# EAGLE design toiletino (EAGLE 9.5.2)
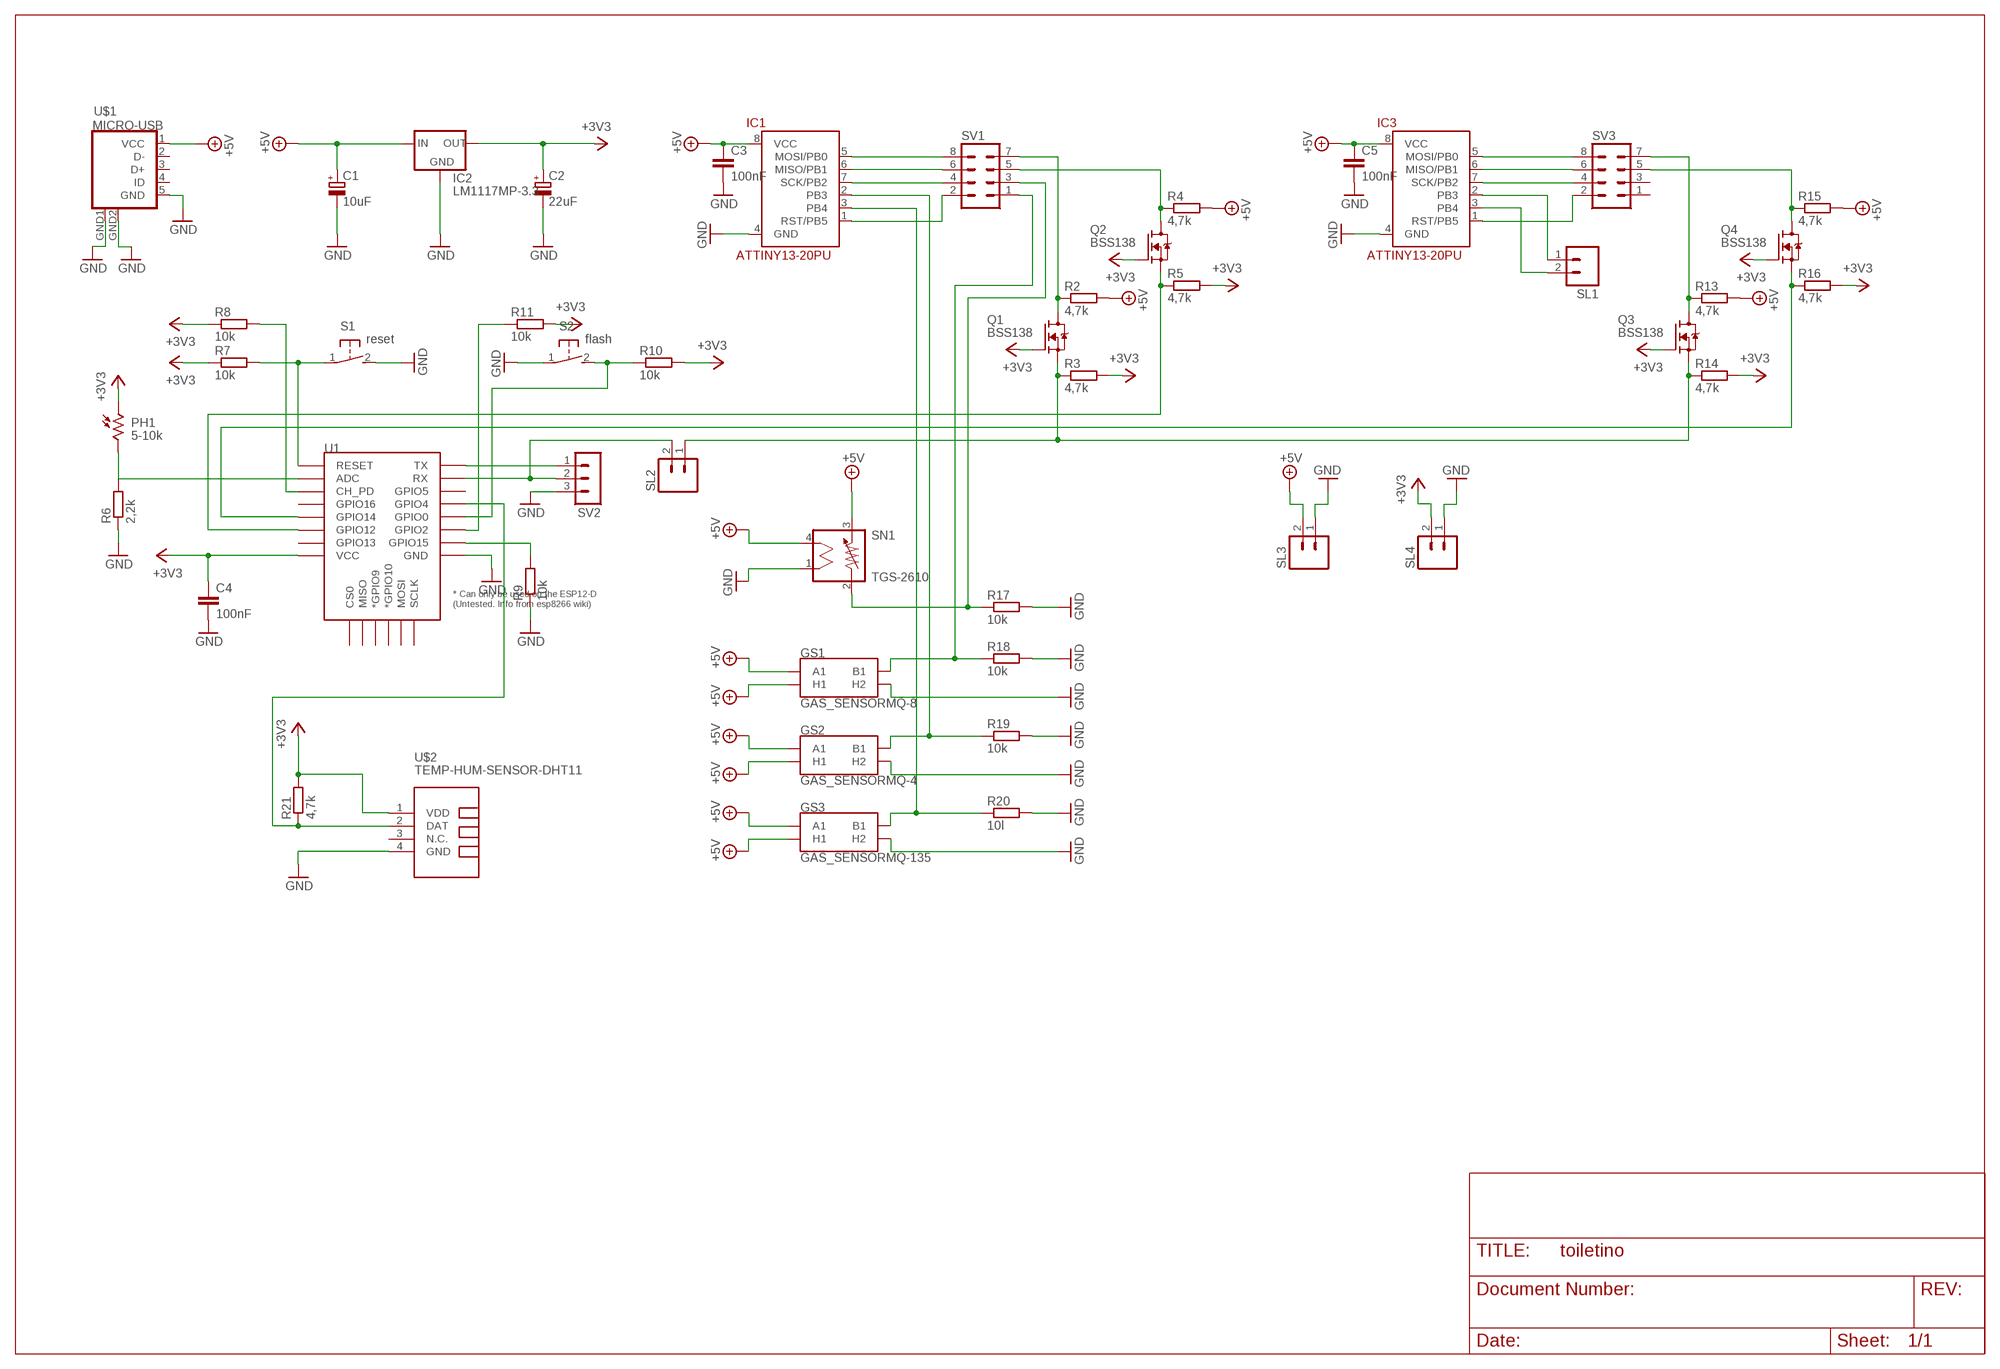
[diagram p0: schematic, sheet 1]

## Parts
C1  10uF  CPOL-EUE2.5-6  [E2,5-6]
C2  22uF  CPOL-EUE2.5-6  [E2,5-6]
C3  100nF  C-EU025-025X050  [C025-025X050]
C4  100nF  C-EU025-025X050  [C025-025X050]
C5  100nF  C-EU025-025X050  [C025-025X050]
GS1  GAS_SENSORMQ-8  [GAS_SENSOR]
GS2  GAS_SENSORMQ-4  [GAS_SENSOR]
GS3  GAS_SENSORMQ-135  GAS_SENSORMQ-3  [GAS_SENSOR]
IC1  ATTINY13-20PU  [DIL08]
IC2  LM1117MP-3.3  [SOT223]
IC3  ATTINY13-20PU  [DIL08]
PH1  5-10k  V1060_21  [TO-5_V10]
Q1  BSS138  [SOT23]
Q2  BSS138  [SOT23]
Q3  BSS138  [SOT23]
Q4  BSS138  [SOT23]
R2  4,7k  R-EU_0207/10  [0207/10]
R3  4,7k  R-EU_0207/10  [0207/10]
R4  4,7k  R-EU_0207/10  [0207/10]
R5  4,7k  R-EU_0207/10  [0207/10]
R6  2,2k  R-EU_0207/10  [0207/10]
R7  10k  R-EU_0207/10  [0207/10]
R8  10k  R-EU_0207/10  [0207/10]
R9  10k  R-EU_0207/10  [0207/10]
R10  10k  R-EU_0207/10  [0207/10]
R11  10k  R-EU_0207/10  [0207/10]
R13  4,7k  R-EU_0207/10  [0207/10]
R14  4,7k  R-EU_0207/10  [0207/10]
R15  4,7k  R-EU_0207/10  [0207/10]
R16  4,7k  R-EU_0207/10  [0207/10]
R17  10k  R-EU_0207/10  [0207/10]
R18  10k  R-EU_0207/10  [0207/10]
R19  10k  R-EU_0207/10  [0207/10]
R20  10l  R-EU_0207/10  [0207/10]
R21  4,7k  R-EU_0207/10  [0207/10]
S1  reset  DTS-3  [DTS-3]
S2  flash  DTS-3  [DTS-3]
SL1  MA02  [02PA]
SL2  MA02  [02PA]
SL3  MA02  [02PA]
SL4  MA02  [02PA]
SN1  TGS-2610  [TGS-2610]
SV1  MA04-2  [MA04-2]
SV2  MA03-1  [MA03-1]
SV3  MA04-2  [MA04-2]
U1  ESP12ESMD  [ESP12E-SMD]
U$1  MICRO-USB  [MICRO-USB]
U$2  TEMP-HUM-SENSOR-DHT11  [TEMP-HUM-SENSOR-DHT11]

## Nets
+3V3: C2.+ C4.1 IC2.2(OUT) IC2.4(OUT) PH1.1 Q1.1(G) Q2.1(G) Q3.1(G) Q4.1(G) R3.2 R5.2 R7.1 R8.1 R10.2 R11.2 R14.2 R16.2 R21.2 SL4.2 U1.VCC U$2.1(VDD)
+5V [small smd]: C1.+ C3.1 C5.1 GS1.A1 GS1.A2(A1) GS1.HA(H1) GS2.A1 GS2.A2(A1) GS2.HA(H1) GS3.A1 GS3.A2(A1) GS3.HA(H1) IC1.8(VCC) IC2.3(IN) IC3.8(VCC) R2.2 R4.2 R13.2 R15.2 SL3.2 SN1.3 SN1.4 U$1.1(VCC)
GND [GND]: C1.- C2.- C3.2 C4.2 C5.2 GS1.HB(H2) GS2.HB(H2) GS3.HB(H2) IC1.4(GND) IC2.1(GND) IC3.4(GND) R6.1 R9.1 R17.2 R18.2 R19.2 R20.2 S1.2 S2.1 SL3.1 SL4.1 SN1.1 SV2.3 U1.GND U$1.5(GND) U$1.GND1(GND) U$1.GND2(GND) U$2.4(GND)
N$1: IC1.1(RST/PB5) SV1.2
N$2: IC1.7(SCK/PB2) SV1.4
N$3: IC1.6(MISO/PB1) SV1.6
N$4: IC1.5(MOSI/PB0) SV1.8
N$5: Q2.3(D) R4.1 SV1.5
N$6: Q1.3(D) R2.1 SV1.7
N$7: Q1.2(S) Q3.2(S) R3.1 R14.1 SL2.1
N$8: Q2.2(S) R5.1 U1.GPIO12
N$9: SV2.1 U1.TXD0(TX)
N$10: PH1.2 R6.2 U1.ADC
N$11: R7.2 S1.1 U1.RESET
N$12: R8.2 U1.CH_PD
N$13: R9.2 U1.GPIO15
N$14: R11.1 U1.GPIO2
N$15: R10.1 S2.2 U1.GPIO0
N$16: IC3.1(RST/PB5) SV3.2
N$17: IC3.7(SCK/PB2) SV3.4
N$18: IC3.6(MISO/PB1) SV3.6
N$19: IC3.5(MOSI/PB0) SV3.8
N$20: Q4.3(D) R15.1 SV3.5
N$21: Q3.3(D) R13.1 SV3.7
N$22: Q4.2(S) R16.1 U1.GPIO14
N$23: R17.1 SN1.2 SV1.3
N$24: IC3.2(PB3) SL1.1
N$25: IC3.3(PB4) SL1.2
N$26: GS1.B1 GS1.B2(B1) R18.1 SV1.1
N$27: R21.1 U1.GPIO4 U$2.2(DAT)
N$28: GS2.B1 GS2.B2(B1) IC1.2(PB3) R19.1
N$29: SL2.2 SV2.2 U1.RXD0(RX)
N$30: GS3.B1 GS3.B2(B1) IC1.3(PB4) R20.1
Unconnected: SV3.1 SV3.3 U1.CS0 U1.GPIO5 U1.GPIO9(*GPIO9) U1.GPIO10(*GPIO10) U1.GPIO13 U1.GPIO16 U1.MISO U1.MOSI U1.SCLK U$1.2(D-) U$1.3(D+) U$1.4(ID) U$2.3(N.C.)

## Library data of the parts
C1 C2 = rcl:CPOL-EU: POLARIZED CAPACITOR, European symbol; SPICEPREFIX: C
C3-C5 = rcl:C-EU: CAPACITOR, European symbol; SPICEPREFIX: C
GS1 = SparkFun-Sensors:GAS_SENSOR: Gas Sensors - MQ-3, MQ-4, MQ-6, MQ-7, MQ-8 Through-hole gas sensors with a heating coil and an analog output. Example Datasheet <https://cdn.sparkfun.com/datasheets/Sensors/Biometric/MQ-3%20ver1.3%20-%20Manual.pdf> SparkFun Products Gas Sensor Breakout Board <https://www.sparkfun.com/products/8891> (BOB-8891) - Breakout board compatible with all gas sensors. Alcohol Gas Sensor - MQ-3 <https://www.sparkfun.com/products/8880> (SEN-08880) Methane CNG Gas Sensor - MQ-4 <https://www.sparkfun.com/products/9404> (SEN-09404) LPG Gas Sensor - MQ-6 <https://www.sparkfun.com/products/9405> (SEN-09405) Carbon Monoxide Sensor - MQ-7 <https://www.sparkfun.com/products/9403> (SEN-09403) Hydrogen Gas Sensor - MQ-8 <https://www.sparkfun.com/products/10916> (SEN-10916); PROD_ID: COMP-13351; SF_ID: SEN-10916
GS2 = SparkFun-Sensors:GAS_SENSOR: Gas Sensors - MQ-3, MQ-4, MQ-6, MQ-7, MQ-8 Through-hole gas sensors with a heating coil and an analog output. Example Datasheet <https://cdn.sparkfun.com/datasheets/Sensors/Biometric/MQ-3%20ver1.3%20-%20Manual.pdf> SparkFun Products Gas Sensor Breakout Board <https://www.sparkfun.com/products/8891> (BOB-8891) - Breakout board compatible with all gas sensors. Alcohol Gas Sensor - MQ-3 <https://www.sparkfun.com/products/8880> (SEN-08880) Methane CNG Gas Sensor - MQ-4 <https://www.sparkfun.com/products/9404> (SEN-09404) LPG Gas Sensor - MQ-6 <https://www.sparkfun.com/products/9405> (SEN-09405) Carbon Monoxide Sensor - MQ-7 <https://www.sparkfun.com/products/9403> (SEN-09403) Hydrogen Gas Sensor - MQ-8 <https://www.sparkfun.com/products/10916> (SEN-10916); PROD_ID: COMP-11559; SF_ID: SEN-09404
GS3 = SparkFun-Sensors:GAS_SENSOR: Gas Sensors - MQ-3, MQ-4, MQ-6, MQ-7, MQ-8 Through-hole gas sensors with a heating coil and an analog output. Example Datasheet <https://cdn.sparkfun.com/datasheets/Sensors/Biometric/MQ-3%20ver1.3%20-%20Manual.pdf> SparkFun Products Gas Sensor Breakout Board <https://www.sparkfun.com/products/8891> (BOB-8891) - Breakout board compatible with all gas sensors. Alcohol Gas Sensor - MQ-3 <https://www.sparkfun.com/products/8880> (SEN-08880) Methane CNG Gas Sensor - MQ-4 <https://www.sparkfun.com/products/9404> (SEN-09404) LPG Gas Sensor - MQ-6 <https://www.sparkfun.com/products/9405> (SEN-09405) Carbon Monoxide Sensor - MQ-7 <https://www.sparkfun.com/products/9403> (SEN-09403) Hydrogen Gas Sensor - MQ-8 <https://www.sparkfun.com/products/10916> (SEN-10916); PROD_ID: COMP-12216; SF_ID: SEN-08880
IC1 IC3 = attiny13:ATTINY13-20*
IC2 = lm1117_10:LM1117?-*: 800mA Low-Dropout Linear Regulator Source: http://www.ti.com/lit/ds/symlink/lm1117-n.pdf; MF: Texas Instruments; MPN: LM1117MP-3.3; OC_FARNELL: 9778195; OC_NEWARK: 28X3416
PH1 = photo-elements:?1060*: Sensor Street Light control Source: http://optoelectronics.perkinelmer.com/content/Datasheets/DTS_PhotocellsB1060.pdf
Q1-Q4 = bss138_10:BSS138: BSS138 N-Channel Logic Level Enhancement Mode Field Effect Transistor Source: http://www.fairchildsemi.com/datasheets/BS/BSS138.pdf; MF: Fairchild; MPN: BSS138; OC_FARNELL: 9845330; OC_NEWARK: 67R2009
R2-R11 R13-R21 = rcl:R-EU_: RESISTOR, European symbol; SPICEPREFIX: R
S1 S2 = switch-tact:DTS-3
SL1-SL4 = con-amp-quick:MA02: AMP QUICK CONNECTOR; OC_FARNELL: unknown; OC_NEWARK: unknown
SN1 = figaro:TGS-2610: SENSOR TGS 2610 - Gas Sensor
SV1 SV3 = con-lstb:MA04-2: PIN HEADER; OC_FARNELL: unknown; OC_NEWARK: unknown
SV2 = con-lstb:MA03-1: PIN HEADER; OC_FARNELL: unknown; OC_NEWARK: unknown
U1 = esp8266modules:ESP12E: ESP12E Module
U$1 = microusb:MICRO-USB: Micro USB B connector
U$2 = diy-modules:TEMP-HUM-SENSOR-DHT11: DHT11 - digital humidity & temperature sensor DHT11 datasheet available here: https://akizukidenshi.com/download/ds/aosong/DHT11.pdf Click here to find device on ebay.com <http://www.ebay.com/sch/dht11+digital+sensor>

## Net classes
0 default: width 0.508 mm
1 power line: width 0.813 mm
3 GND: clearance 0.305 mm

## Board
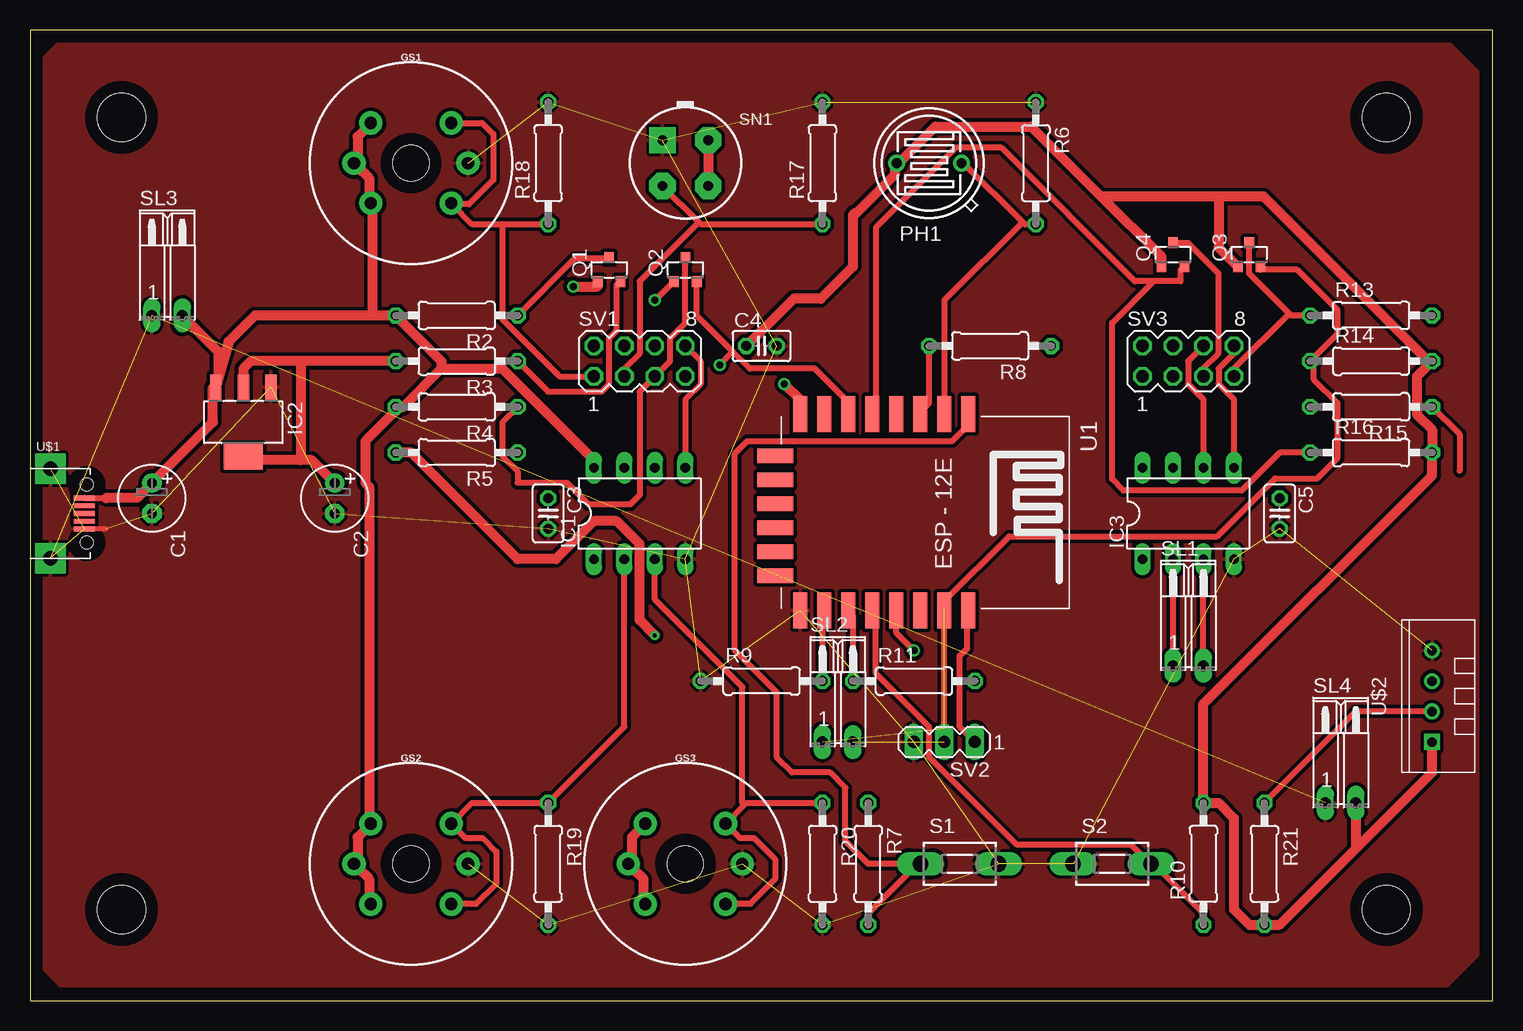
[diagram p1: board, top side]
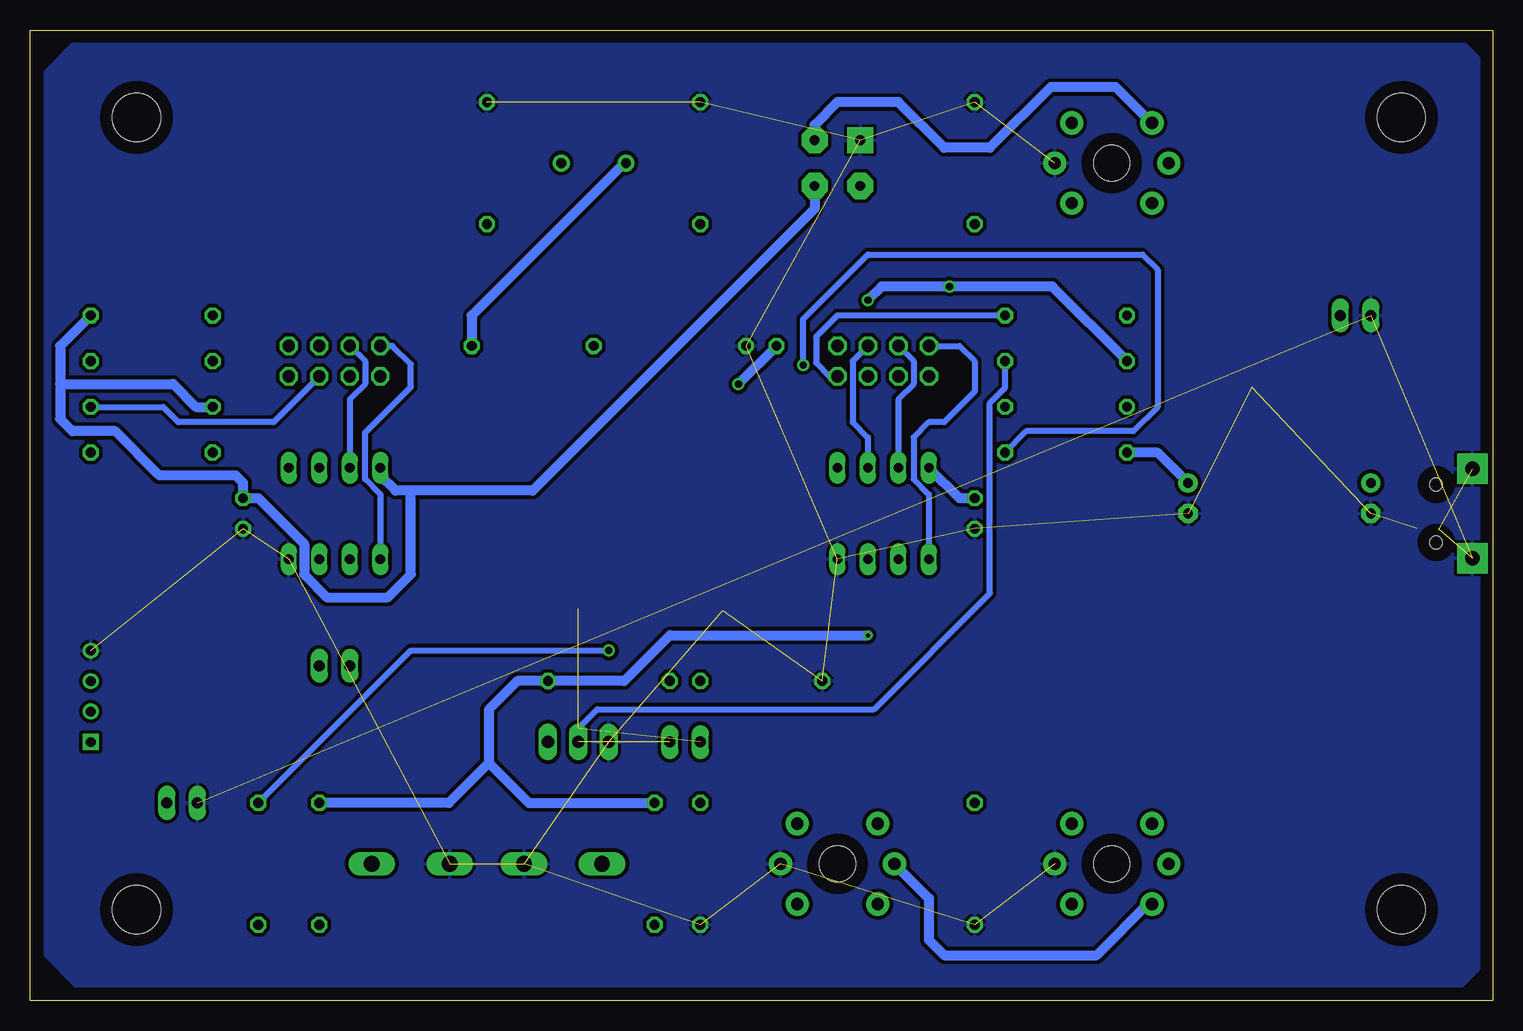
[diagram p2: board, bottom side, seen from below]

Size 121.9 x 80.95 mm. Coordinates in mm from the lower left corner, seen from the top.
Outline: 0,0 121.9,0 121.9,80.95 0,80.95 0,0
Copper layers (1*16): Top 0.035mm / dielectric 1.5mm / Bottom 0.035mm
Design rules "default *": minimum track width 6mil, minimum drill 0.35mm, track to track 12.5mil, track to pad 6mil, pad to pad 6mil, via to via 6mil, smd to smd 6mil, copper to edge 40mil, drill to drill 6mil, minimum pad ring 10mil, minimum via ring 8mil, stop-mask expansion 4mil, vias tented up to drill 0mil, thermal gap 10mil
Holes 4 mm at 7.62,73.66 7.62,7.62 113.03,7.62 113.03,73.66

### Footprints (pad centres in the part's own frame; a part is rotated, then mirrored left to right if it is on the bottom)
E2,5-6 = drill 0.813 pad 1.6: + -1.27,0 | drill 0.813 pad 1.6 octagon: - 1.27,0
C025-025X050 = drill 0.813 octagon: 1 -1.27,0; 2 1.27,0
GAS_SENSOR = drill 1.016 pad 1.93: A1 -3.35,3.35; A2 -3.35,-3.35; B1 3.35,3.35; B2 3.35,-3.35; HA -4.75,0; HB 4.75,0 | hole 3: 0,0
DIL08 = drill 0.813 long: 1 -3.81,-3.81; 2 -1.27,-3.81; 3 1.27,-3.81; 4 3.81,-3.81; 5 3.81,3.81; 6 1.27,3.81; 7 -1.27,3.81; 8 -3.81,3.81
SOT223 = smd 0.95 x 2.15: 1 -2.3,-2.9; 2 0,-2.9; 3 2.3,-2.9 | smd 3.25 x 2.15: 4 0,2.9
TO-5_V10 = drill 0.8 pad 1.4: 1 -2.7,0; 2 2.7,0
SOT23 = smd 0.8 x 0.9: 1 -0.95,-1; 2 0.95,-1; 3 0,1
0207/10 = drill 0.813 octagon: 1 -5.08,0; 2 5.08,0
DTS-3 = drill 1.3 long: 1 -3.25,0; 2 3.25,0
02PA = drill 0.914 long: 1 -1.27,0; 2 1.27,0
TGS-2610 = drill 0.813 pad 2.184 square: 1 -1.905,1.905 | drill 0.813 pad 2.184 octagon: 2 -1.905,-1.905; 3 1.905,-1.905; 4 1.905,1.905
MA04-2 = drill 1.016 octagon: 1 -3.81,-1.27; 2 -3.81,1.27; 3 -1.27,-1.27; 4 -1.27,1.27; 5 1.27,-1.27; 6 1.27,1.27; 7 3.81,-1.27; 8 3.81,1.27
MA03-1 = drill 1.016 long: 1 -2.54,0; 2 0,0; 3 2.54,0
ESP12E-SMD = smd 3 x 1.2: ADC -8.3,3.8; CH_PD -8.3,1.8; GND 8.1,-8.2; GPIO0 8.1,-2.2; GPIO2 8.1,-4.2; GPIO4 8.1,-0.2; GPIO5 8.1,1.8; GPIO12 -8.3,-4.2; GPIO13 -8.3,-6.2; GPIO14 -8.3,-2.2; GPIO15 8.1,-6.2; GPIO16 -8.3,-0.2; RESET -8.3,5.8; RXD0 8.1,3.8; TXD0 8.1,5.8; VCC -8.3,-8.2 | smd 1.2 x 3: CS0 -4.8,-10.3; GPIO9 -0.8,-10.3; GPIO10 1.2,-10.3; MISO -2.8,-10.3; MOSI 3.2,-10.3; SCLK 5.2,-10.3
MICRO-USB = smd 0.4 x 1.75: 1 -1.3,4.525; 2 -0.65,4.525; 3 0,4.525; 4 0.65,4.525; 5 1.3,4.525 | drill 1.2 pad 2.54 square: GND1 -3.725,1.7; GND2 3.725,1.7 | hole 1.05: -2.425,4.73; 2.425,4.73
TEMP-HUM-SENSOR-DHT11 = drill 0.8 square: 1 -3.81,0 | drill 0.8: 2 -1.27,0; 3 1.27,0; 4 3.81,0

### Placement (x,y rotation side)
C1  10.16,41.91 270 top
C2  25.4,41.91 270 top
C3  43.18,40.64 270 top
C4  60.96,54.61 0 top
C5  104.14,40.64 270 top
GS1  31.75,69.85 0 top
GS2  31.75,11.43 0 top
GS3  54.61,11.43 0 top
IC1  50.8,40.64 0 top
IC2  17.78,48.26 180 top
IC3  96.52,40.64 0 top
PH1  74.93,69.85 0 top
Q1  48.26,60.96 0 top
Q2  54.61,60.96 0 top
Q3  101.6,62.23 0 top
Q4  95.25,62.23 0 top
R2  35.56,57.15 180 top
R3  35.56,53.34 180 top
R4  35.56,49.53 180 top
R5  35.56,45.72 180 top
R6  83.82,69.85 270 top
R7  69.85,11.43 270 top
R8  80.01,54.61 180 top
R9  60.96,26.67 0 top
R10  97.79,11.43 90 top
R11  73.66,26.67 0 top
R13  111.76,57.15 0 top
R14  111.76,53.34 0 top
R15  111.76,49.53 180 top
R16  111.76,45.72 0 top
R17  66.04,69.85 90 top
R18  43.18,69.85 90 top
R19  43.18,11.43 270 top
R20  66.04,11.43 270 top
R21  102.87,11.43 270 top
S1  77.47,11.43 0 top
S2  90.17,11.43 0 top
SL1  96.52,27.94 0 top
SL2  67.31,21.59 0 top
SL3  11.43,57.15 0 top
SL4  109.22,16.51 0 top
SN1  54.61,69.85 0 top
SV1  50.8,53.34 0 top
SV2  76.2,21.59 180 top
SV3  96.52,53.34 0 top
U1  72.39,40.64 270 top
U$1  0,40.64 270 top
U$2  116.84,25.4 90 top

### Tracks (layer width: path | path; a pad name or v marks a point on that pad's centre or on a via)
+3V3  (via drill 0.35, 0.6)
  Top 0.508: Q2.1 52.12,58.42
  Top 0.813: 89.28,67.06 83.44,72.9 75.44,72.9 72.39,69.85 PH1.1 72.07,69.53 72.07,68.9 68.83,65.66 68.71,65.66 68.58,65.53 68.58,61.21 65.91,58.55 63.63,58.55 C4.1 | Q4.1 94.3,62.04 89.28,67.06 | v62.87,51.44 64.14,50.16 64.14,49.21 U1.VCC | 22.54,45.09 23.5,45.09 C2.+ | 22.54,45.09 17.78,45.09 IC2.4 | v45.28,59.56 47.31,59.56 Q1.1 | R3.2 22.54,53.34 | 22.54,53.34 18.41,53.34 17.78,52.7 IC2.2 | 22.54,53.34 22.54,45.09 | R5.2 31.75,45.72 40.64,36.83 43.81,36.83 46.99,40.01 48.9,40.01 50.8,38.1 50.8,31.75 v52.07,30.48 | Q3.1 99.06,62.82 99.06,67.06 | 52.12,58.42 v52.07,58.42 | U$2.1 116.84,19.05 110.49,12.7 | 110.49,12.7 104.14,6.35 R21.2 101.6,6.35 100.33,7.62 100.33,15.24 99.06,16.51 R10.2 97.79,24.77 116.84,43.81 R16.2 116.84,47.62 115.57,48.89 115.57,52.07 R14.2 116.68,53.18 102.81,67.06 99.06,67.06 | 99.06,67.06 89.28,67.06 | SL4.2 110.49,12.7
  Bottom 0.813: R8.1 85.09,57.15 72.39,69.85 PH1.1 | C4.1 v62.87,51.44 | R5.2 27.94,45.72 C2.+ | R3.2 36.7,59.56 v45.28,59.56 50.93,59.56 v52.07,58.42 | R7.1 80.33,16.51 83.66,19.84 | R10.2 87,16.51 83.66,19.84 | 83.66,19.84 83.66,24.29 81.28,26.67 R11.2 78.74,26.35 78.42,26.67 72.39,26.67 68.58,30.48 v52.07,30.48
+5V
  Top 0.406: 6.34,41.92 6.35,41.91
  Top 0.508: U$1.1 6.32,41.94 6.34,41.92
  Top 0.813: SN1.4 SN1.3 | GS1.A1 28.26,73.03 27.3,72.07 27.3,69.85 GS1.HA 27.3,69.53 28.26,68.58 28.26,66.67 GS1.A2 28.57,66.36 28.57,57.15 | GS2.A2 28.26,8.25 28.26,10.16 27.3,11.11 GS2.HA 27.3,11.43 27.3,13.65 28.26,14.61 GS2.A1 28.26,14.92 28.26,42.86 27.94,43.18 27.94,46.67 30.48,49.21 R4.2 31.11,49.53 34.29,52.7 | GS3.A1 51.12,14.61 50.16,13.65 50.16,11.43 GS3.HA 50.16,11.11 51.12,10.16 51.12,8.25 GS3.A2 | 34.29,52.7 34.29,53.34 R2.2 28.57,57.15 | IC1.8 46.99,45.09 39.37,52.7 34.29,52.7 | 28.57,57.15 18.73,57.15 16.55,54.97 15.7,51.94 | 15.7,51.94 IC2.3 15.24,51.12 15.24,48.26 C1.+ 8.92,41.94 6.36,41.94 6.34,41.92 | SL3.2 15.7,54.15 15.7,51.94
  Bottom 0.813: 119.38,51.44 119.38,54.61 R13.2 | IC3.8 92.71,43.81 91.44,42.55 90.17,42.55 | 90.17,42.55 90.17,35.56 92.08,33.66 97.16,33.66 99.06,35.56 99.06,38.1 102.87,41.91 C5.1 104.14,43.18 104.78,43.81 111.12,43.81 114.81,47.5 118.36,47.5 119.38,48.51 119.38,51.44 | R15.2 108.08,49.53 109.98,51.44 119.38,51.44 | GS1.A1 28.57,73.34 31.43,76.2 36.83,76.2 41.91,71.12 45.72,71.12 49.53,74.93 54.61,74.93 56.52,73.03 SN1.4 | GS2.A2 28.57,8.25 33.02,3.81 45.72,3.81 46.99,5.08 46.99,8.56 GS3.HA | C3.1 44.45,41.91 IC1.8 | 90.17,42.55 80.01,42.55 56.52,66.04 SN1.3
GND  (27 unrouted)
  Top 0.406: U$1.5 4.55,39.37 6.35,39.37
  pour Top: 2.54,80.01 118.11,80.01 120.65,77.47 120.65,3.81 118.11,1.27 2.54,1.27 0,3.81 0,77.47
  pour Bottom: 2.54,80.01 118.11,80.01 120.65,77.47 120.65,3.81 118.11,1.27 2.54,1.27 0,3.81 0,77.47
N$1
  Bottom 0.508: IC1.1 46.99,42.23 48.26,43.5 48.26,46.99 46.99,48.26 45.72,48.26 43.18,50.8 43.18,53.34 44.45,54.61 SV1.2
N$2
  Bottom 0.508: IC1.7 49.53,50.16 48.26,51.44 48.26,53.34 SV1.4
N$3
  Bottom 0.508: SV1.6 53.34,53.34 53.34,48.26 52.07,46.99 IC1.6
N$4
  Top 0.508: IC1.5 54.61,50.16 55.88,51.44 55.88,53.34 SV1.8
N$5
  Top 0.508: R4.1 39.37,48.26 39.37,45.4 40.64,44.13 40.64,43.18 44.77,43.18 46.55,41.4 50.04,41.4 50.8,42.16 50.8,50.8 SV1.5 | Q2.3 54.61,56.52 53.34,55.25 53.34,53.34 SV1.5 | 52.39,52.07 SV1.5
N$6
  Top 0.508: R2.1 45.4,61.91 48.26,61.91 Q1.3
  Bottom 0.508: SV1.7 55.24,52.07 56.39,53.21 56.39,55.37 54.61,57.15 R2.1
N$7  (2 unrouted)
  Top 0.508: R3.1 43.18,50.8 47.62,50.8 48.26,51.44 48.26,55.25 48.9,55.88 48.9,59.69 Q1.2 | Q3.2 102.55,60.96 105.6,60.96 108.97,57.59 108.97,55.63 R14.1 107,53.34 107,51.82 108.97,49.85 108.97,45.28 107.25,43.56 103.76,43.56 98.93,38.73 81.6,38.73 76.2,33.34 76.2,32.7
  Bottom 0.508: R3.1 40.64,51.12 41.91,49.85 41.91,33.97 51.56,24.32 74.61,24.32 76.2,22.73
N$8  (via drill 0.6)
  Top 0.508: 58.58,54.13 60.01,52.7 65.41,52.7 67.94,50.16 67.94,49.21 U1.GPIO12 | 58.58,54.13 55.56,57.15 55.56,59.69 Q2.2 | 58.58,54.13 v57.47,53.02
  Bottom 0.508: v57.47,53.02 57.47,56.83 52.07,62.23 29.21,62.23 27.94,60.96 27.94,49.53 29.97,47.5 38.86,47.5 R5.1
N$9
  Top 0.508: SV2.1 77.47,22.86 77.47,28.77 78.11,29.4 78.11,32.38 U1.TXD0
N$10
  Top 0.508: R6.2 82.87,64.77 82.71,64.93 | 82.71,64.93 77.79,69.85 PH1.2 | 82.71,64.93 76.2,58.42 76.2,49.21 U1.ADC
N$11
  Top 0.508: R7.2 69.85,7.3 73.98,11.43 S1.1 | U1.RESET 78.11,48.89 78.11,47.94 76.83,46.67 59.75,46.67 58.74,45.66 58.74,29.21 62.23,25.72 62.23,20.32 63.5,19.05 66.67,19.05 67.94,17.78 67.94,13.34 69.85,11.43 S1.1 | 73.66,11.43 S1.1
N$12
  Top 0.508: R8.2 74.93,49.85 74.3,49.21 U1.CH_PD
N$13
  Top 0.508: R9.2 66.04,32.38 U1.GPIO15
N$14
  Top 0.508: R11.1 68.58,32.07 68.26,32.38 U1.GPIO2
N$15
  Top 0.508: R10.1 97.79,7.3 93.66,11.43 S2.2 93.34,11.43 91.76,13.02 82.23,13.02 74.93,20.32 74.93,22.86 70.48,27.3 70.48,32.38 U1.GPIO0
N$16
  Bottom 0.508: IC3.1 92.71,42.23 93.98,43.5 93.98,47.37 90.17,51.18 90.17,53.09 91.69,54.61 SV3.2
N$17
  Bottom 0.508: IC3.7 95.25,50.16 93.98,51.44 93.98,53.34 SV3.4
N$18
  Top 0.508: IC3.6 97.79,50.16 96.52,51.44 96.52,53.34 SV3.6
N$19
  Top 0.508: IC3.5 100.33,50.16 99.06,51.44 99.06,52.7 100.33,53.98 SV3.8
N$20
  Top 0.508: 119.13,44.2 119.13,47.24 R15.1 | SV3.5 97.79,52.7 99.06,53.98 99.06,60.64 96.52,63.18 95.25,63.18 Q4.3
  Bottom 0.508: R15.1 110.81,49.53 109.54,48.26 101.6,48.26 SV3.5
N$21
  Top 0.508: Q3.3 101.6,60.64 104.93,57.31 | 104.93,57.31 105.09,57.15 R13.1 | SV3.7 100.33,52.7 104.93,57.31
N$22
  Top 0.508: 93.66,60.01 90.17,56.52 90.17,43.5 91.12,42.55 100.97,42.55 104.14,45.72 R16.1 | Q4.2 95.89,60.96 95.89,60.01 93.66,60.01 | 93.66,60.01 92.08,60.01 80.96,71.12 77.15,71.12 70.48,64.45 70.48,49.21 U1.GPIO14
N$23
  Top 0.508: R17.1 55.88,64.77 55.72,64.93 | SN1.2 55.72,64.93 | SV1.3 49.53,52.7 50.8,53.98 50.8,60.01 55.72,64.93
N$24
  Top 0.508: SL1.1 IC3.2
N$25
  Top 0.508: SL1.2 IC3.3
N$26
  Top 0.508: 39.37,64.77 36.83,64.77 35.18,66.42 | 39.37,64.77 R18.1 | GS1.B2 35.18,66.42 | SV1.1 44.13,52.07 39.37,56.83 39.37,64.77 | GS1.B1 37.67,73.2 38.61,72.26 38.61,68.45 36.58,66.42 35.18,66.42
N$27  (via drill 0.6)
  Top 0.508: R21.1 110.49,24.13 U$2.2 | U1.GPIO4 72.19,30.68 v73.66,29.21
  Bottom 0.508: R21.1 90.17,29.21 v73.66,29.21
N$28
  Top 0.508: IC1.2 49.53,22.86 R19.1 36.83,16.51 GS2.B1 36.29,13.59 37.72,13.59 38.86,12.45 38.86,9.78 37.16,8.08 GS2.B2
N$29  (1 unrouted)
  Top 0.508: SV2.2 76.2,32.38 U1.RXD0
N$30
  Top 0.508: R20.1 59.69,16.51 59.53,16.35 | 59.53,16.35 GS3.B1 59.15,13.59 60.33,13.59 62.1,11.81 62.1,10.16 60.02,8.08 GS3.B2 | IC1.3 52.07,33.46 59.37,26.16 59.37,16.51 59.53,16.35